# Altium project Led_7_sec_Project_1.PrjPcb
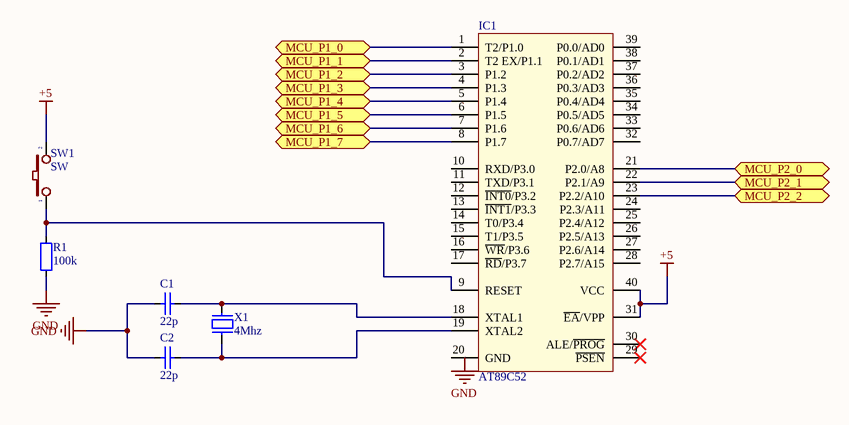
[diagram p0: 02 - MCU.SchDoc]
4 sheets, 31 parts. Net scope: flat (ports and power ports of the same name join across sheets).
Board file: PCBoki.PcbDoc
Sheets:
  02 - MCU.SchDoc
  03 - LED7SEC.SchDoc
  04 - BUTTON.SchDoc
  05 - POWER.SchDoc

## Sheet 02 - MCU.SchDoc
size A; SheetNumber: 2; SheetTotal: 5

### Parts
C1  22p  [CAP_0402]
C2  22p  [CAP_0402]
IC1  AT89C52  [DIP40/W0.6]
R1  100k  [RES-SMD-0101]
SW1  SW  [SW2]
X1  4Mhz  [XT2]

### Ports
MCU_P1_0 (bidir), MCU_P1_1 (bidir), MCU_P1_2 (bidir), MCU_P1_3 (bidir), MCU_P1_4 (bidir), MCU_P1_5 (bidir), MCU_P1_6 (bidir), MCU_P1_7 (bidir), MCU_P2_0 (bidir), MCU_P2_1 (bidir), MCU_P2_2 (bidir)

### Nets
+5: IC1.31(~{EA}/VPP) IC1.40(VCC) SW1.2
GND: C1.1 C2.1 R1.1
NetC1_2: C1.2 IC1.18(XTAL1) X1.2
NetC2_2: C2.2 IC1.19(XTAL2) X1.1
NetIC1_1: IC1.1(T2/P1.0) ; port MCU_P1_0
NetIC1_2: IC1.2(T2_EX/P1.1) ; port MCU_P1_1
NetIC1_3: IC1.3(P1.2) ; port MCU_P1_2
NetIC1_4: IC1.4(P1.3) ; port MCU_P1_3
NetIC1_5: IC1.5(P1.4) ; port MCU_P1_4
NetIC1_6: IC1.6(P1.5) ; port MCU_P1_5
NetIC1_7: IC1.7(P1.6) ; port MCU_P1_6
NetIC1_8: IC1.8(P1.7) ; port MCU_P1_7
NetIC1_9: IC1.9(RESET) R1.2 SW1.1
NetIC1_21: IC1.21(P2.0/A8) ; port MCU_P2_0
NetIC1_22: IC1.22(P2.1/A9) ; port MCU_P2_1
NetIC1_23: IC1.23(P2.2/A10) ; port MCU_P2_2

Not connected (* = marked no-connect by the designer): IC1 10(RXD/P3.0) 11(TXD/P3.1) 12(~{INT0}/P3.2) 13(~{INT1}/P3.3) 14(T0/P3.4) 15(T1/P3.5) 16(~{WR}/P3.6) 17(~{RD}/P3.7) 20(GND) 24(P2.3/A11) 25(P2.4/A12) 26(P2.5/A13) 27(P2.6/A14) 28(P2.7/A15) 29(~{PSEN})* 30(ALE/~{PROG})* 32(P0.7/AD7) 33(P0.6/AD6) 34(P0.5/AD5) 35(P0.4/AD4) 36(P0.3/AD3) 37(P0.2/AD2) 38(P0.1/AD1) 39(P0.0/AD0)

### Notes on the sheet
- Labels drawn without touching a wire or pin: GND

### Library data of the parts
C1 C2 = CapSMD: Capacitor; Value: 33p; Published: 8-Jun-2000; LatestRevisionDate: 17-Jul-2002; LatestRevisionNote: Re-released for DXP Platform.; PackageReference: RAD-0.3; Publisher: Altium Limited
IC1 = AT89C52: Atmel AT89C52, 8k Byte Flash Memory , 40 Pin; Value: AT89C52
R1 = Resistor - SMD: Resistor; Manufacturer: Generic Components; Class: Passive; Published: 08/06/2000; Publisher: Altium Hobart Technology Centre
SW1 = SW2: Switch button 2 pin; Value: SW chip 2 pin
X1 = XT2: Crystal For all Crystal 2pin.; Value: 4Mhz

## Sheet 03 - LED7SEC.SchDoc
size A; SheetNumber: 2; SheetTotal: 4
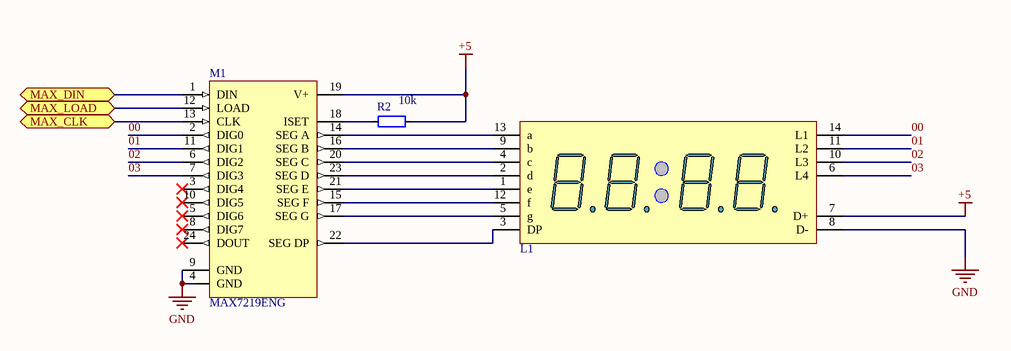
[diagram p1: 03 - LED7SEC.SchDoc]

### Parts
L1  Led 7 Seg 4 digit - Anode  [LED7SEG-4-0.56-RG]  (value not drawn)
M1  MAX7219ENG  [DIP24/W0.3]
R2  10k  [RES-SMD-0101]

### Ports
MAX_CLK (bidir), MAX_DIN (bidir), MAX_LOAD (bidir)

### Nets
+5: L1.7(D+) M1.19(V+) R2.1
GND: L1.8(D-) M1.4(GND) M1.9(GND)
00: L1.14(L1) M1.2(DIG0)
01: L1.11(L2) M1.11(DIG1)
02: L1.10(L3) M1.6(DIG2)
03: L1.6(L4) M1.7(DIG3)
NetL1_1: L1.1(e) M1.21(SEG_E)
NetL1_2: L1.2(d) M1.23(SEG_D)
NetL1_3: L1.3(DP) M1.22(SEG_DP)
NetL1_4: L1.4(c) M1.20(SEG_C)
NetL1_5: L1.5(g) M1.17(SEG_G)
NetL1_9: L1.9(b) M1.16(SEG_B)
NetL1_12: L1.12(f) M1.15(SEG_F)
NetL1_13: L1.13(a) M1.14(SEG_A)
NetM1_1: M1.1(DIN) ; port MAX_DIN
NetM1_12: M1.12(LOAD) ; port MAX_LOAD
NetM1_13: M1.13(CLK) ; port MAX_CLK
NetM1_18: M1.18(ISET) R2.2

Not connected (* = marked no-connect by the designer): M1 3(DIG4)* 5(DIG6)* 8(DIG7)* 10(DIG5)* 24(DOUT)*

### Library data of the parts
L1 = LED7SEG-4-RG
M1 = MAX7219ENG: Serially Interfaced, 8-Digit LED Display Driver; Published: 16-Jan-2001; LatestRevisionDate: 29-May-2009; LatestRevisionNote: Component Body Added.; DatasheetVersion: Jul-1997; PackageVersion: 1997; PackageReference: NG24A; Publisher: Altium Limited; PackageDescription: DIP, 24-Pin, Row Spacing 7.62 mm, Pitch 2.54 mm; Code_JEDEC: MS-001-AF; ComponentLink1Description: Manufacturer Link; ComponentLink1URL: http://www.maxim-ic.com/; ComponentLink2Description: Datasheet; ComponentLink2URL: http://pdfserv.maxim-ic.com/en/ds/MAX7219-MAX7221.pdf
R2 = Resistor - SMD: as R1 on sheet 02 - MCU; Published: 08/06/2000; Publisher: Altium Hobart Technology Centre

## Sheet 04 - BUTTON.SchDoc
size A; SheetNumber: 3; SheetTotal: 4
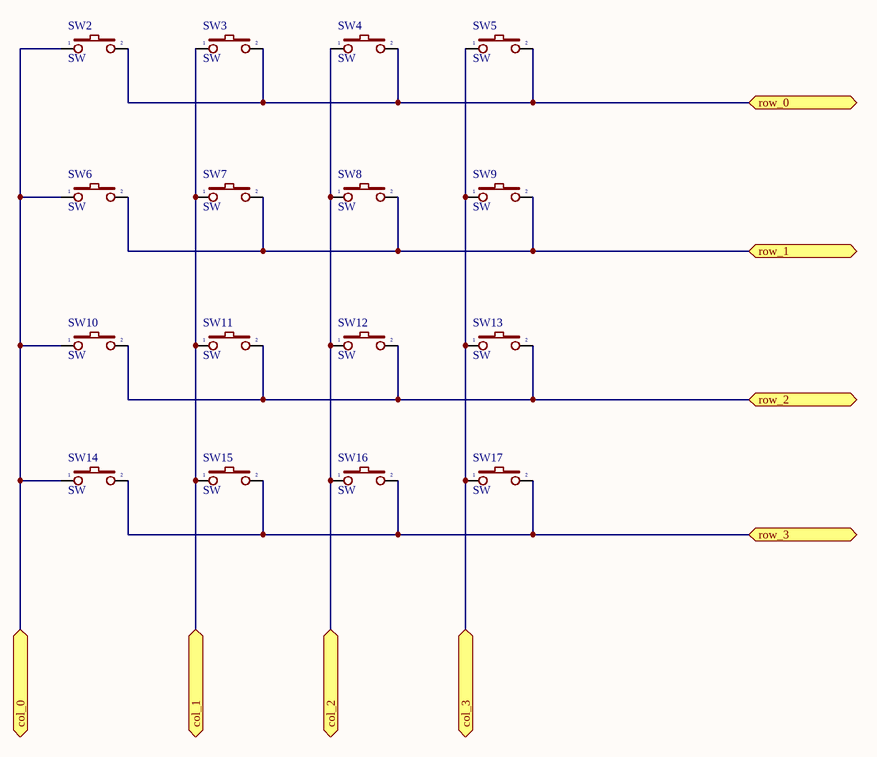
[diagram p2: 04 - BUTTON.SchDoc]

### Parts
SW2  SW  [SW2]
SW3  SW  [SW2]
SW4  SW  [SW2]
SW5  SW  [SW2]
SW6  SW  [SW2]
SW7  SW  [SW2]
SW8  SW  [SW2]
SW9  SW  [SW2]
SW10  SW  [SW2]
SW11  SW  [SW2]
SW12  SW  [SW2]
SW13  SW  [SW2]
SW14  SW  [SW2]
SW15  SW  [SW2]
SW16  SW  [SW2]
SW17  SW  [SW2]

### Ports
col_0 (bidir), col_1 (bidir), col_2 (bidir), col_3 (bidir), row_0 (bidir), row_1 (bidir), row_2 (bidir), row_3 (bidir)

### Nets
NetSW2_1: SW2.1 SW6.1 SW10.1 SW14.1 ; port col_0
NetSW2_2: SW2.2 SW3.2 SW4.2 SW5.2 ; port row_0
NetSW3_1: SW3.1 SW7.1 SW11.1 SW15.1 ; port col_1
NetSW4_1: SW4.1 SW8.1 SW12.1 SW16.1 ; port col_2
NetSW5_1: SW5.1 SW9.1 SW13.1 SW17.1 ; port col_3
NetSW6_2: SW6.2 SW7.2 SW8.2 SW9.2 ; port row_1
NetSW10_2: SW10.2 SW11.2 SW12.2 SW13.2 ; port row_2
NetSW14_2: SW14.2 SW15.2 SW16.2 SW17.2 ; port row_3

### Library data of the parts
SW2-SW17 = SW2: as SW1 on sheet 02 - MCU

## Sheet 05 - POWER.SchDoc
size A; SheetNumber: 4; SheetTotal: 4
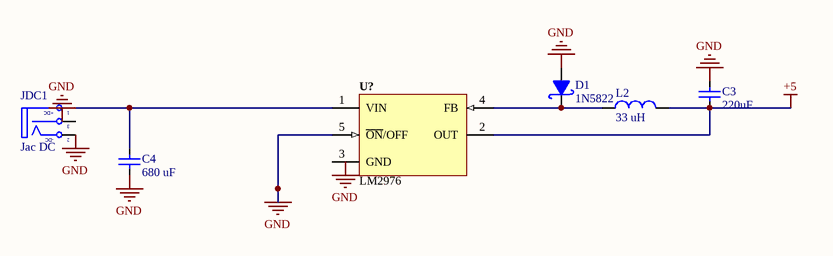
[diagram p3: 05 - POWER.SchDoc]

### Parts
C3  220uF  [CAP_0402]
C4  680 uF  [CAP_0402]
D1  1N5822  [SMA]
JDC1  Jac DC  [DC-IN]
L2  33 uH  [L/0.4]
U?  LM2976  [TO-263]

### Nets
+5: C3.1 L2.2 U?.2(OUT)
GND: C3.2 C4.1 D1.1(A) JDC1.2(TN) U?.5(~{ON}/OFF)
NetC4_2: C4.2 JDC1.1(T) U?.1(VIN)
NetD1_2: D1.2(K) L2.1 U?.4(FB)

Not connected (* = marked no-connect by the designer): JDC1 3(S); U? 3(GND)

### Notes on the sheet
- Labels drawn without touching a wire or pin: GND
- (in symbol DCIN) +DC; -DC

### Library data of the parts
C3 C4 = CapSMD: Capacitor; Value: 33p; Published: 8-Jun-2000; LatestRevisionDate: 17-Jul-2002; LatestRevisionNote: Re-released for DXP Platform.; PackageReference: RAD-0.3; Publisher: Altium Limited
D1 = 1N5822: Schottky Rectifiers; Value: Diode c?m 1N5408
JDC1 = DCIN: Jac DC input; Value: Jac DC
L2 = L1: Inductor; Value: 150 mH
U? = LM2596: Max Input Voltage: 12 V; Max Output Current: 3 (6.0 peak) A; Max Output Voltage: mV; Category: IC-Power; Min Input Voltage: mV; Min Output Voltage: mV; Mounting Technology: Surface Mount; Status: Unreleased; Supply Voltage: mV; Temperature Range: -40 to +125 degC

## Nets that join several sheets
+5: 02 - MCU (IC1.31 IC1.40 SW1.2), 03 - LED7SEC (L1.7 M1.19 R2.1), 05 - POWER (C3.1 L2.2 U?.2)
GND: 02 - MCU (C1.1 C2.1 R1.1), 03 - LED7SEC (L1.8 M1.4 M1.9), 05 - POWER (5 pins)